# EAGLE design temperature-sensor (EAGLE 5.00)
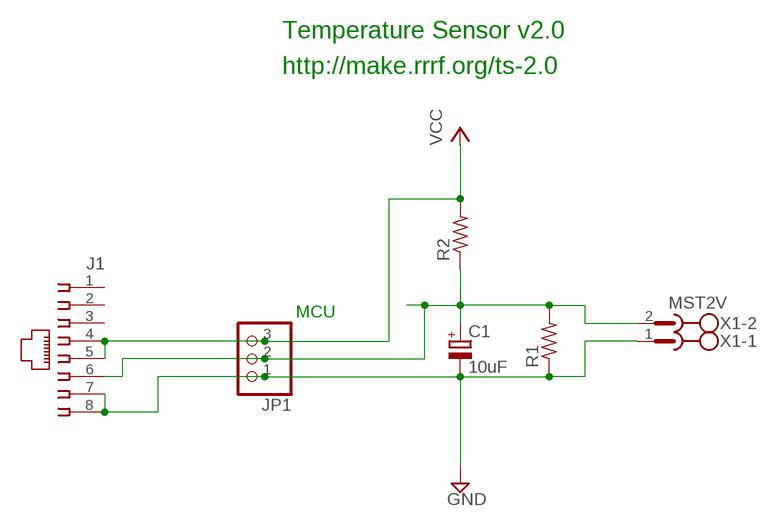
[diagram p0: schematic, sheet 1]

## Parts
C1  10uF  CPOL-EUE2-5  [E2-5]
J1  520426-4  [520426-4]
JP1  PINHD-1X3  [1X03]
R1  R-US_0207/7  [0207/7]
R2  R-US_0207/7  [0207/7]
X1  MST2V  [MSTBV2]

## Nets
GND: C1.- J1.7 J1.8 JP1.1 R1.1 X1.1
N$2: C1.+ J1.6 JP1.2 R1.2 R2.1 X1.2
VCC: J1.4 J1.5 JP1.3 R2.2
Unconnected: J1.1 J1.2 J1.3

## Notes on the sheet
- Temperature Sensor v2.0
- http://make.rrrf.org/ts-2.0
- MCU

## Library data of the parts
C1 = rcl:CPOL-EU: POLARIZED CAPACITOR, European symbol
J1 = con-amp:520426-4: AMP connector
JP1 = pinhead:PINHD-1X3: PIN HEADER
R1 R2 = rcl:R-US_: RESISTOR, American symbol
X1 = con-phoenix-508:MST2V: PHOENIX

## Net classes
0 default: width 0.406 mm, clearance 0.406 mm

## Board
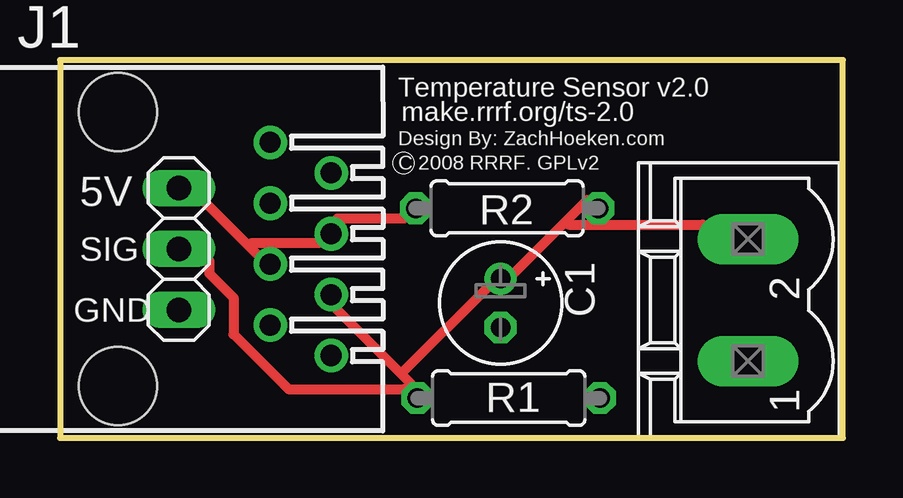
[diagram p1: board, top side]
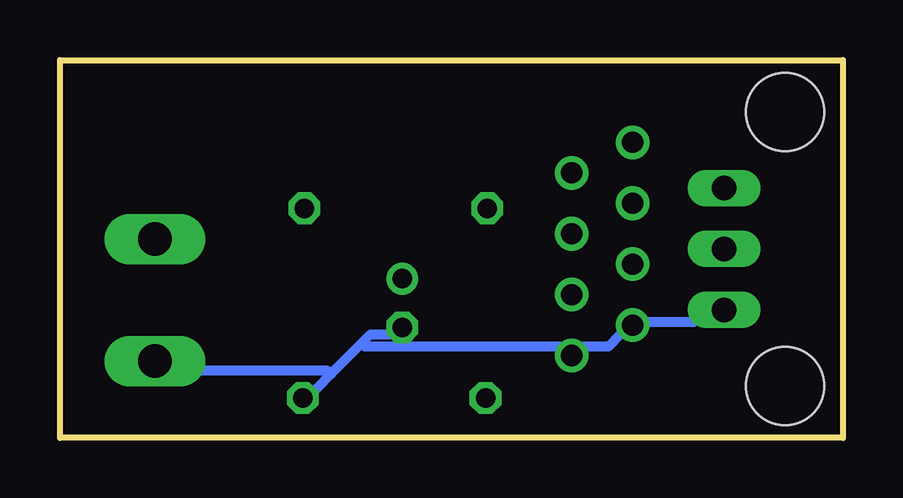
[diagram p2: board, bottom side, seen from below]

Size 32.64 x 15.75 mm. Coordinates in mm from the lower left corner, seen from the top.
Outline: 32.64,15.75 0,15.75 0,0 32.64,0 32.64,15.75
Copper layers (1*16): Top 0.035mm / dielectric 1.5mm / Bottom 0.035mm
Design rules "default": minimum track width 10mil, minimum drill 24mil, track to track 8mil, track to pad 8mil, pad to pad 8mil, via to via 8mil, smd to smd 8mil, copper to edge 40mil, drill to drill 8mil, minimum pad ring 10mil, minimum via ring 8mil, stop-mask expansion 4mil, vias tented up to drill 0mil, thermal gap 10mil

### Footprints (pad centres in the part's own frame; a part is rotated, then mirrored left to right if it is on the bottom)
E2-5 = drill 0.813 pad 1.27 round: + -1.016,0 | drill 0.813 pad 1.27 octagon: - 1.016,0
520426-4 = drill 0.889 round: 1 -4.445,6.35; 2 -3.175,8.89; 3 -1.905,6.35; 4 -0.635,8.89; 5 0.635,6.35; 6 1.905,8.89; 7 3.175,6.35; 8 4.445,8.89 | hole 3.251: -5.715,0; 5.715,0
1X03 = drill 1.016 long: 1 -2.54,0; 2 0,0; 3 2.54,0
0207/7 = drill 0.813 octagon: 1 -3.81,0; 2 3.81,0
MSTBV2 = drill 1.397 long: 1 -2.54,0; 2 2.54,0

### Placement (x,y rotation side)
C1  18.37,5.62 270 top
J1  2.41,7.87 270 top
JP1  4.95,7.87 90 top
R1  18.71,1.66 180 top
R2  18.64,9.57 180 top
X1  28.68,5.75 90 top

### Tracks (layer width: path | path; a pad name or v marks a point on that pad's centre or on a via)
GND
  Bottom 0.406: JP1.1 6.22,4.83 8.25,4.83 J1.7 9.27,4.32 9.78,3.81 10.79,3.81 J1.8 11.81,3.81 19.94,3.81 20.07,3.94 | 21.34,2.67 21.97,2.03 R1.1 | 20.07,3.94 21.34,2.67 | 20.07,3.94 19.69,4.32 18.92,4.32 C1.- | X1.1 26.8,2.79 21.46,2.79 21.34,2.67
N$2
  Top 0.406: 21.08,9.02 21.97,9.91 R2.1 | 21.08,9.02 18.92,6.86 C1.+ 17.91,6.35 14.22,2.67 | X1.2 26.8,8.89 21.21,8.89 21.08,9.02 | 14.22,2.67 11.56,5.33 J1.6 | 14.22,2.67 14.6,2.29 R1.2 14.35,2.03 9.53,2.03 7.24,4.32 7.24,5.84 6.22,6.86 6.22,7.37 JP1.2
VCC
  Top 0.406: R2.2 14.35,9.14 11.56,9.14 J1.4 10.79,8.13 8,8.13 7.87,8 | 7.87,8 5.97,9.91 JP1.3 | 7.87,8 8.25,7.62 J1.5

### Text on the board
tPlace: Temperature Sensor v2.0 | make.rrrf.org/ts-2.0 | Design By: ZachHoeken.com | C 2008 RRRF. GPLv2 | 5V | SIG | GND